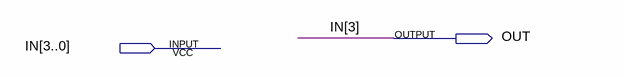
[diagram p0: schematic sheet]
// Quartus schematic FLAG_NEGATIVE.bdf as structural Verilog: 0 symbols, 2 pins
module FLAG_NEGATIVE (
  input  [3:0] IN,
  output OUT
);


  assign OUT = IN[3];
endmodule
